# Altium project Customer.PrjPcb
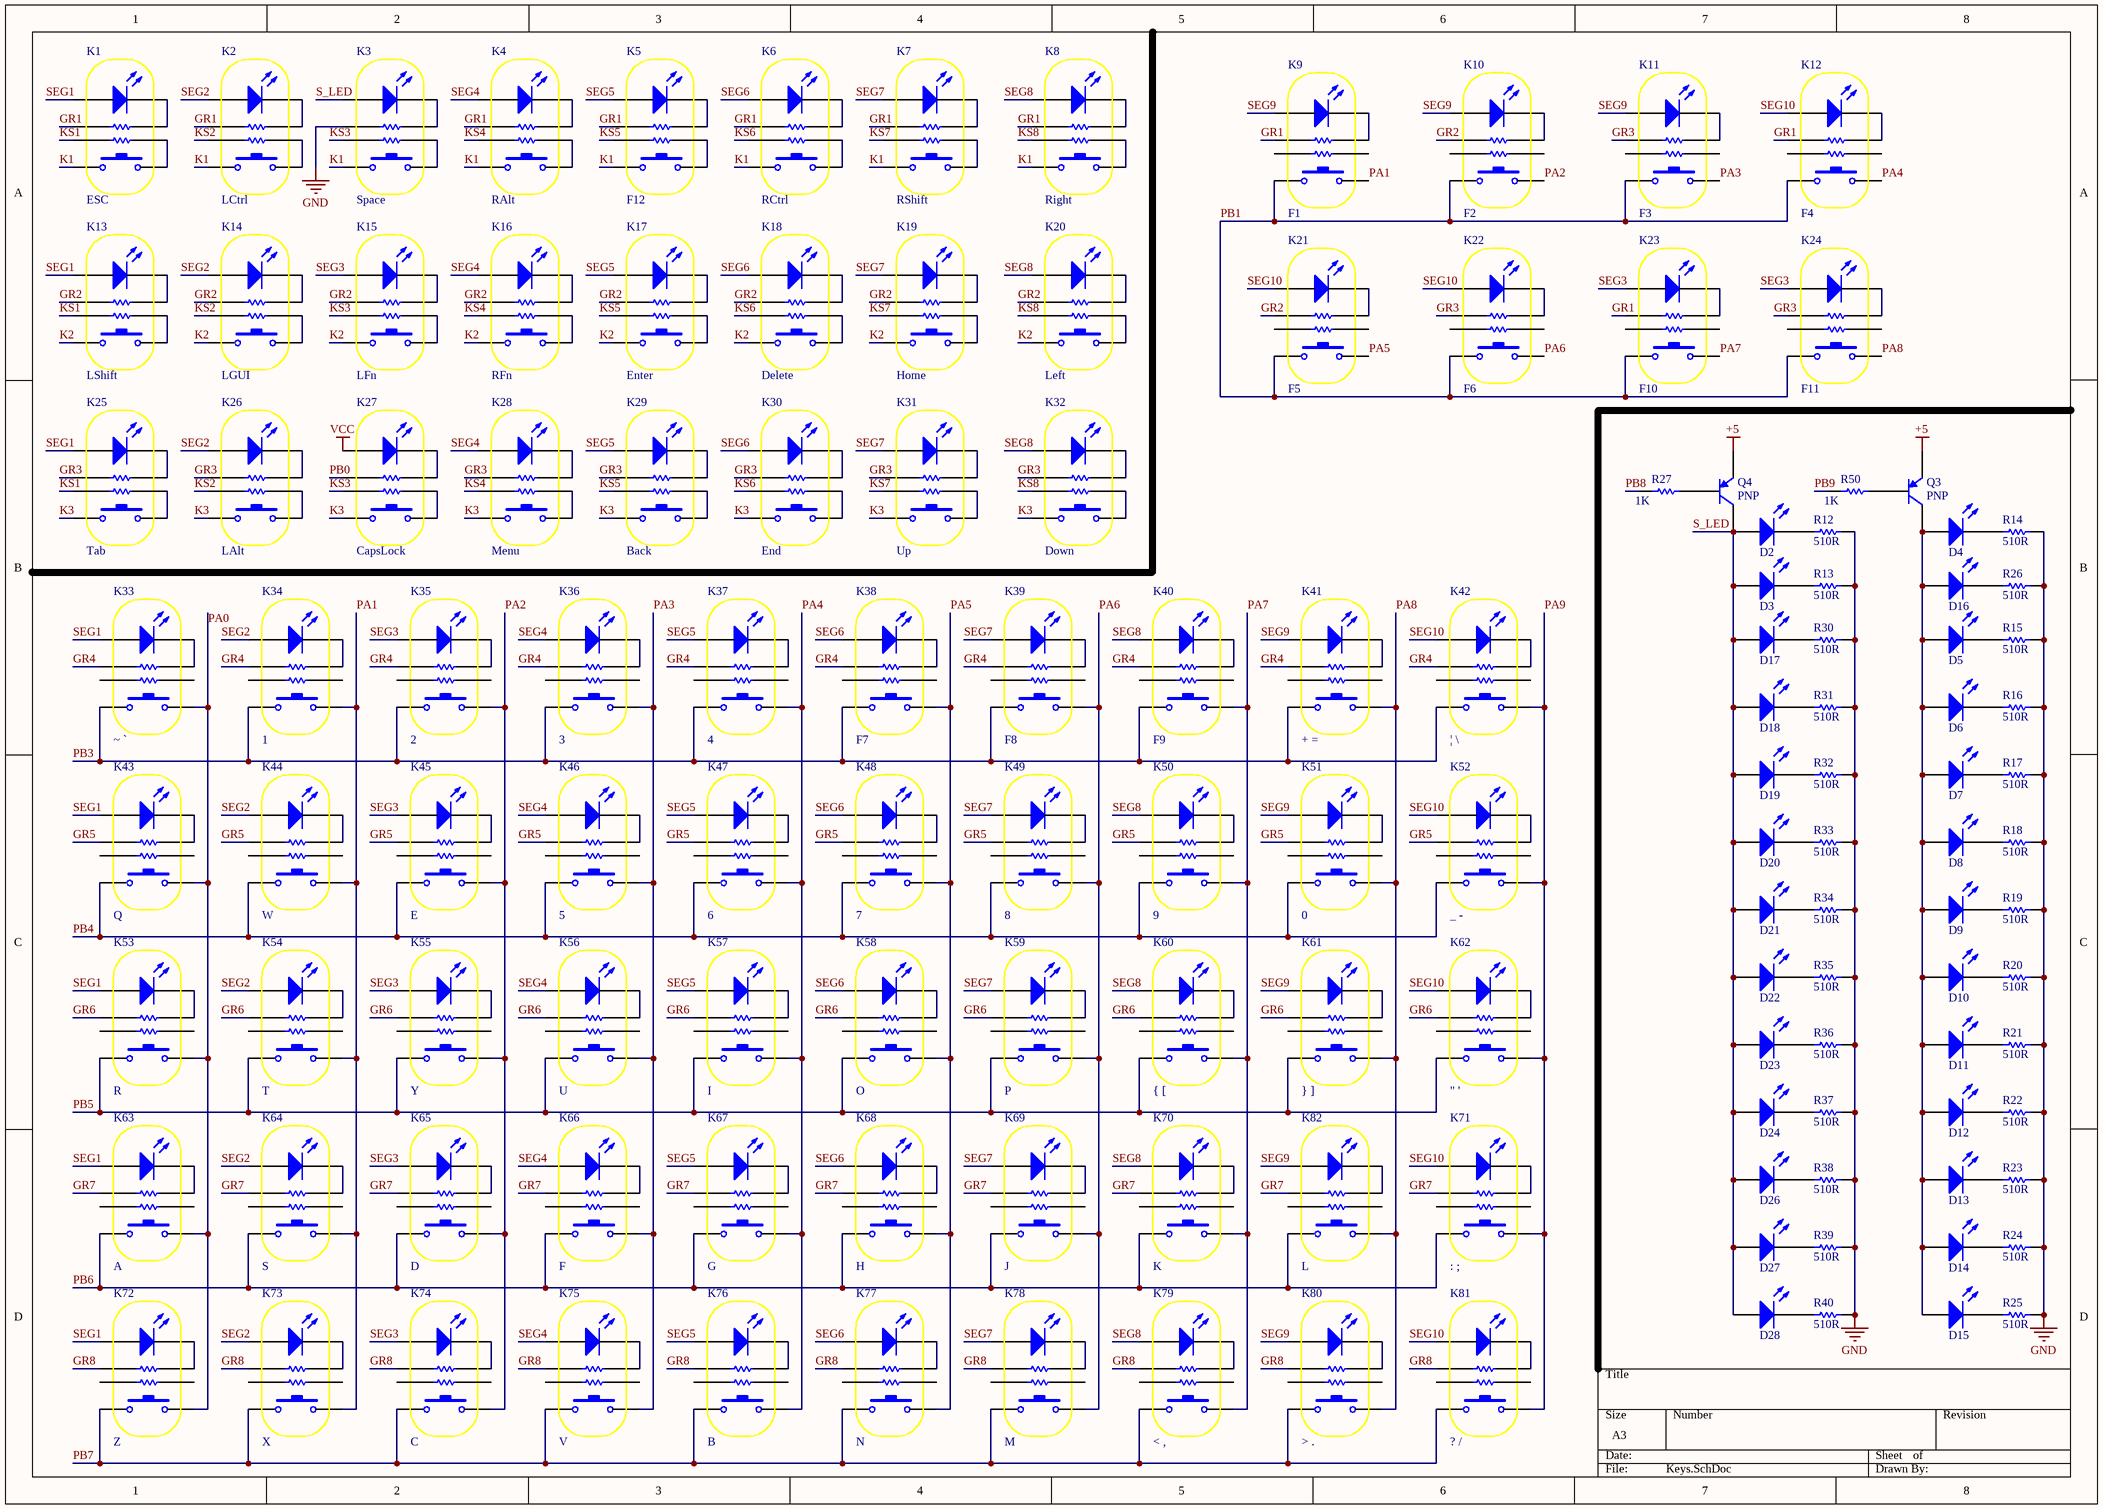
[diagram p0: Keys.SchDoc]
2 sheets, 207 parts. Net scope: global (net labels, ports and power ports of the same name join across sheets).
Board file: PCB.PcbDoc
Sheets:
  Keys.SchDoc
  Main.SchDoc

## Sheet Keys.SchDoc
size A3

### Parts
D2  LED  [LC-0603_LED_S3]  (value not drawn)
D3  LED  [LC-0603_LED_S3]  (value not drawn)
D4  LED  [LC-0603_LED_S3]  (value not drawn)
D5  LED  [LC-0603_LED_S3]  (value not drawn)
D6  LED  [LC-0603_LED_S3]  (value not drawn)
D7  LED  [LC-0603_LED_S3]  (value not drawn)
D8  LED  [LC-0603_LED_S3]  (value not drawn)
D9  LED  [LC-0603_LED_S3]  (value not drawn)
D10  LED  [LC-0603_LED_S3]  (value not drawn)
D11  LED  [LC-0603_LED_S3]  (value not drawn)
D12  LED  [LC-0603_LED_S3]  (value not drawn)
D13  LED  [LC-0603_LED_S3]  (value not drawn)
D14  LED  [LC-0603_LED_S3]  (value not drawn)
D15  LED  [LC-0603_LED_S3]  (value not drawn)
D16  LED  [LC-0603_LED_S3]  (value not drawn)
D17  LED  [LC-0603_LED_S3]  (value not drawn)
D18  LED  [LC-0603_LED_S3]  (value not drawn)
D19  LED  [LC-0603_LED_S3]  (value not drawn)
D20  LED  [LC-0603_LED_S3]  (value not drawn)
D21  LED  [LC-0603_LED_S3]  (value not drawn)
D22  LED  [LC-0603_LED_S3]  (value not drawn)
D23  LED  [LC-0603_LED_S3]  (value not drawn)
D24  LED  [LC-0603_LED_S3]  (value not drawn)
D26  LED  [LC-0603_LED_S3]  (value not drawn)
D27  LED  [LC-0603_LED_S3]  (value not drawn)
D28  LED  [LC-0603_LED_S3]  (value not drawn)
K1  ESC  [Key]
K2  LCtrl  [Key]
K3  Space  [Key]
K4  RAlt  [Key]
K5  F12  [Key]
K6  RCtrl  [Key]
K7  RShift  [Key]
K8  Right  [Key]
K9  F1  [Key]
K10  F2  [Key]
K11  F3  [Key]
K12  F4  [Key]
K13  LShift  [Key]
K14  LGUI  [Key]
K15  LFn  [Key]
K16  RFn  [Key]
K17  Enter  [Key]
K18  Delete  [Key]
K19  Home  [Key]
K20  Left  [Key]
K21  F5  [Key]
K22  F6  [Key]
K23  F10  [Key]
K24  F11  [Key]
K25  Tab  [Key]
K26  LAlt  [Key]
K27  CapsLock  [Key]
K28  Menu  [Key]
K29  Back  [Key]
K30  End  [Key]
K31  Up  [Key]
K32  Down  [Key]
K33  ~ `  [Key]
K34  1  [Key]
K35  2  [Key]
K36  3  [Key]
K37  4  [Key]
K38  F7  [Key]
K39  F8  [Key]
K40  F9  [Key]
K41  + =  [Key]
K42  | \  [Key]
K43  Q  [Key]
K44  W  [Key]
K45  E  [Key]
K46  5  [Key]
K47  6  [Key]
K48  7  [Key]
K49  8  [Key]
K50  9  [Key]
K51  0  [Key]
K52  _ -  [Key]
K53  R  [Key]
K54  T  [Key]
K55  Y  [Key]
K56  U  [Key]
K57  I  [Key]
K58  O  [Key]
K59  P  [Key]
K60  { [  [Key]
K61  } ]  [Key]
K62  " '  [Key]
K63  A  [Key]
K64  S  [Key]
K65  D  [Key]
K66  F  [Key]
K67  G  [Key]
K68  H  [Key]
K69  J  [Key]
K70  K  [Key]
K71  : ;  [Key]
K72  Z  [Key]
K73  X  [Key]
K74  C  [Key]
K75  V  [Key]
K76  B  [Key]
K77  N  [Key]
K78  M  [Key]
K79  < ,  [Key]
K80  > .  [Key]
K81  ? /  [Key]
K82  L  [Key]
Q3  PNP  [LC-SOT-23(SOT-23-3)]
Q4  PNP  [LC-SOT-23(SOT-23-3)]
R12  510R  [LC-0603_R]
R13  510R  [LC-0603_R]
R14  510R  [LC-0603_R]
R15  510R  [LC-0603_R]
R16  510R  [LC-0603_R]
R17  510R  [LC-0603_R]
R18  510R  [LC-0603_R]
R19  510R  [LC-0603_R]
R20  510R  [LC-0603_R]
R21  510R  [LC-0603_R]
R22  510R  [LC-0603_R]
R23  510R  [LC-0603_R]
R24  510R  [LC-0603_R]
R25  510R  [LC-0603_R]
R26  510R  [LC-0603_R]
R27  1K  [LC-0603_R]
R30  510R  [LC-0603_R]
R31  510R  [LC-0603_R]
R32  510R  [LC-0603_R]
R33  510R  [LC-0603_R]
R34  510R  [LC-0603_R]
R35  510R  [LC-0603_R]
R36  510R  [LC-0603_R]
R37  510R  [LC-0603_R]
R38  510R  [LC-0603_R]
R39  510R  [LC-0603_R]
R40  510R  [LC-0603_R]
R50  1K  [LC-0603_R]

### Nets
+5: Q3.3(E) Q4.3(E)
GND: K3.2(K) R12.2 R13.2 R14.2 R15.2 R16.2 R17.2 R18.2 R19.2 R20.2 R21.2 R22.2 R23.2 R24.2 R25.2 R26.2 R30.2 R31.2 R32.2 R33.2 R34.2 R35.2 R36.2 R37.2 R38.2 R39.2 R40.2
VCC: K27.1(A)
GR1: K1.2(K) K2.2(K) K4.2(K) K5.2(K) K6.2(K) K7.2(K) K8.2(K) K9.2(K) K12.2(K) K23.2(K)
GR2: K10.2(K) K13.2(K) K14.2(K) K15.2(K) K16.2(K) K17.2(K) K18.2(K) K19.2(K) K20.2(K) K21.2(K)
GR3: K11.2(K) K22.2(K) K24.2(K) K25.2(K) K26.2(K) K28.2(K) K29.2(K) K30.2(K) K31.2(K) K32.2(K)
GR4: K33.2(K) K34.2(K) K35.2(K) K36.2(K) K37.2(K) K38.2(K) K39.2(K) K40.2(K) K41.2(K) K42.2(K)
GR5: K43.2(K) K44.2(K) K45.2(K) K46.2(K) K47.2(K) K48.2(K) K49.2(K) K50.2(K) K51.2(K) K52.2(K)
GR6: K53.2(K) K54.2(K) K55.2(K) K56.2(K) K57.2(K) K58.2(K) K59.2(K) K60.2(K) K61.2(K) K62.2(K)
GR7: K63.2(K) K64.2(K) K65.2(K) K66.2(K) K67.2(K) K68.2(K) K69.2(K) K70.2(K) K71.2(K) K82.2(K)
GR8: K72.2(K) K73.2(K) K74.2(K) K75.2(K) K76.2(K) K77.2(K) K78.2(K) K79.2(K) K80.2(K) K81.2(K)
K1: K1.4 K2.4 K3.4 K4.4 K5.4 K6.4 K7.4 K8.4
K2: K13.4 K14.4 K15.4 K16.4 K17.4 K18.4 K19.4 K20.4
K3: K25.4 K26.4 K27.4 K28.4 K29.4 K30.4 K31.4 K32.4
KS1: K1.1(A) K1.3(A) K13.1(A) K13.3(A) K25.1(A) K25.3(A) K33.1(A) K43.1(A) K53.1(A) K63.1(A) K72.1(A)  [also labelled SEG1]
KS2: K2.1(A) K2.3(A) K14.1(A) K14.3(A) K26.1(A) K26.3(A) K34.1(A) K44.1(A) K54.1(A) K64.1(A) K73.1(A)  [also labelled SEG2]
KS3: K3.3(A) K15.1(A) K15.3(A) K23.1(A) K24.1(A) K27.3(A) K35.1(A) K45.1(A) K55.1(A) K65.1(A) K74.1(A)  [also labelled SEG3]
KS4: K4.1(A) K4.3(A) K16.1(A) K16.3(A) K28.1(A) K28.3(A) K36.1(A) K46.1(A) K56.1(A) K66.1(A) K75.1(A)  [also labelled SEG4]
KS5: K5.1(A) K5.3(A) K17.1(A) K17.3(A) K29.1(A) K29.3(A) K37.1(A) K47.1(A) K57.1(A) K67.1(A) K76.1(A)  [also labelled SEG5]
KS6: K6.1(A) K6.3(A) K18.1(A) K18.3(A) K30.1(A) K30.3(A) K38.1(A) K48.1(A) K58.1(A) K68.1(A) K77.1(A)  [also labelled SEG6]
KS7: K7.1(A) K7.3(A) K19.1(A) K19.3(A) K31.1(A) K31.3(A) K39.1(A) K49.1(A) K59.1(A) K69.1(A) K78.1(A)  [also labelled SEG7]
KS8: K8.1(A) K8.3(A) K20.1(A) K20.3(A) K32.1(A) K32.3(A) K40.1(A) K50.1(A) K60.1(A) K70.1(A) K79.1(A)  [also labelled SEG8]
PA0: K33.5 K43.5 K53.5 K63.5 K72.5
PA1: K9.5 K34.5 K44.5 K54.5 K64.5 K73.5
PA2: K10.5 K35.5 K45.5 K55.5 K65.5 K74.5
PA3: K11.5 K36.5 K46.5 K56.5 K66.5 K75.5
PA4: K12.5 K37.5 K47.5 K57.5 K67.5 K76.5
PA5: K21.5 K38.5 K48.5 K58.5 K68.5 K77.5
PA6: K22.5 K39.5 K49.5 K59.5 K69.5 K78.5
PA7: K23.5 K40.5 K50.5 K60.5 K70.5 K79.5
PA8: K24.5 K41.5 K51.5 K61.5 K80.5 K82.5
PA9: K42.5 K52.5 K62.5 K71.5 K81.5
PB0: K27.2(K)
PB1: K9.4 K10.4 K11.4 K12.4 K21.4 K22.4 K23.4 K24.4
PB3: K33.4 K34.4 K35.4 K36.4 K37.4 K38.4 K39.4 K40.4 K41.4 K42.4
PB4: K43.4 K44.4 K45.4 K46.4 K47.4 K48.4 K49.4 K50.4 K51.4 K52.4
PB5: K53.4 K54.4 K55.4 K56.4 K57.4 K58.4 K59.4 K60.4 K61.4 K62.4
PB6: K63.4 K64.4 K65.4 K66.4 K67.4 K68.4 K69.4 K70.4 K71.4 K82.4
PB7: K72.4 K73.4 K74.4 K75.4 K76.4 K77.4 K78.4 K79.4 K80.4 K81.4
PB8: R27.1
PB9: R50.1
S_LED: D2.A D3.A D17.A D18.A D19.A D20.A D21.A D22.A D23.A D24.A D26.A D27.A D28.A K3.1(A) Q4.1(C)
SEG9: K9.1(A) K10.1(A) K11.1(A) K41.1(A) K51.1(A) K61.1(A) K80.1(A) K82.1(A)
SEG10: K12.1(A) K21.1(A) K22.1(A) K42.1(A) K52.1(A) K62.1(A) K71.1(A) K81.1(A)
NetD2_K: D2.K R12.1
NetD3_K: D3.K R13.1
NetD4_A: D4.A D5.A D6.A D7.A D8.A D9.A D10.A D11.A D12.A D13.A D14.A D15.A D16.A Q3.1(C)
NetD4_K: D4.K R14.1
NetD5_K: D5.K R15.1
NetD6_K: D6.K R16.1
NetD7_K: D7.K R17.1
NetD8_K: D8.K R18.1
NetD9_K: D9.K R19.1
NetD10_K: D10.K R20.1
NetD11_K: D11.K R21.1
NetD12_K: D12.K R22.1
NetD13_K: D13.K R23.1
NetD14_K: D14.K R24.1
NetD15_K: D15.K R25.1
NetD16_K: D16.K R26.1
NetD17_K: D17.K R30.1
NetD18_K: D18.K R31.1
NetD19_K: D19.K R32.1
NetD20_K: D20.K R33.1
NetD21_K: D21.K R34.1
NetD22_K: D22.K R35.1
NetD23_K: D23.K R36.1
NetD24_K: D24.K R37.1
NetD26_K: D26.K R38.1
NetD27_K: D27.K R39.1
NetD28_K: D28.K R40.1
NetK1_5: K1.5 K1.6(K)
NetK1_7: K1.7(K) K1.8(K)
NetK2_5: K2.5 K2.6(K)
NetK2_7: K2.7(K) K2.8(K)
NetK3_5: K3.5 K3.6(K)
NetK3_7: K3.7(K) K3.8(K)
NetK4_5: K4.5 K4.6(K)
NetK4_7: K4.7(K) K4.8(K)
NetK5_5: K5.5 K5.6(K)
NetK5_7: K5.7(K) K5.8(K)
NetK6_5: K6.5 K6.6(K)
NetK6_7: K6.7(K) K6.8(K)
NetK7_5: K7.5 K7.6(K)
NetK7_7: K7.7(K) K7.8(K)
NetK8_5: K8.5 K8.6(K)
NetK8_7: K8.7(K) K8.8(K)
NetK9_7: K9.7(K) K9.8(K)
NetK10_7: K10.7(K) K10.8(K)
NetK11_7: K11.7(K) K11.8(K)
NetK12_7: K12.7(K) K12.8(K)
NetK13_5: K13.5 K13.6(K)
NetK13_7: K13.7(K) K13.8(K)
NetK14_5: K14.5 K14.6(K)
NetK14_7: K14.7(K) K14.8(K)
NetK15_5: K15.5 K15.6(K)
NetK15_7: K15.7(K) K15.8(K)
NetK16_5: K16.5 K16.6(K)
NetK16_7: K16.7(K) K16.8(K)
NetK17_5: K17.5 K17.6(K)
NetK17_7: K17.7(K) K17.8(K)
NetK18_5: K18.5 K18.6(K)
NetK18_7: K18.7(K) K18.8(K)
NetK19_5: K19.5 K19.6(K)
NetK19_7: K19.7(K) K19.8(K)
NetK20_5: K20.5 K20.6(K)
NetK20_7: K20.7(K) K20.8(K)
NetK21_7: K21.7(K) K21.8(K)
NetK22_7: K22.7(K) K22.8(K)
NetK23_7: K23.7(K) K23.8(K)
NetK24_7: K24.7(K) K24.8(K)
NetK25_5: K25.5 K25.6(K)
NetK25_7: K25.7(K) K25.8(K)
NetK26_5: K26.5 K26.6(K)
NetK26_7: K26.7(K) K26.8(K)
NetK27_5: K27.5 K27.6(K)
NetK27_7: K27.7(K) K27.8(K)
NetK28_5: K28.5 K28.6(K)
NetK28_7: K28.7(K) K28.8(K)
NetK29_5: K29.5 K29.6(K)
NetK29_7: K29.7(K) K29.8(K)
NetK30_5: K30.5 K30.6(K)
NetK30_7: K30.7(K) K30.8(K)
NetK31_5: K31.5 K31.6(K)
NetK31_7: K31.7(K) K31.8(K)
NetK32_5: K32.5 K32.6(K)
NetK32_7: K32.7(K) K32.8(K)
NetK33_7: K33.7(K) K33.8(K)
NetK34_7: K34.7(K) K34.8(K)
NetK35_7: K35.7(K) K35.8(K)
NetK36_7: K36.7(K) K36.8(K)
NetK37_7: K37.7(K) K37.8(K)
NetK38_7: K38.7(K) K38.8(K)
NetK39_7: K39.7(K) K39.8(K)
NetK40_7: K40.7(K) K40.8(K)
NetK41_7: K41.7(K) K41.8(K)
NetK42_7: K42.7(K) K42.8(K)
NetK43_7: K43.7(K) K43.8(K)
NetK44_7: K44.7(K) K44.8(K)
NetK45_7: K45.7(K) K45.8(K)
NetK46_7: K46.7(K) K46.8(K)
NetK47_7: K47.7(K) K47.8(K)
NetK48_7: K48.7(K) K48.8(K)
NetK49_7: K49.7(K) K49.8(K)
NetK50_7: K50.7(K) K50.8(K)
NetK51_7: K51.7(K) K51.8(K)
NetK52_7: K52.7(K) K52.8(K)
NetK53_7: K53.7(K) K53.8(K)
NetK54_7: K54.7(K) K54.8(K)
NetK55_7: K55.7(K) K55.8(K)
NetK56_7: K56.7(K) K56.8(K)
NetK57_7: K57.7(K) K57.8(K)
NetK58_7: K58.7(K) K58.8(K)
NetK59_7: K59.7(K) K59.8(K)
NetK60_7: K60.7(K) K60.8(K)
NetK61_7: K61.7(K) K61.8(K)
NetK62_7: K62.7(K) K62.8(K)
NetK63_7: K63.7(K) K63.8(K)
NetK64_7: K64.7(K) K64.8(K)
NetK65_7: K65.7(K) K65.8(K)
NetK66_7: K66.7(K) K66.8(K)
NetK67_7: K67.7(K) K67.8(K)
NetK68_7: K68.7(K) K68.8(K)
NetK69_7: K69.7(K) K69.8(K)
NetK70_7: K70.7(K) K70.8(K)
NetK71_7: K71.7(K) K71.8(K)
NetK72_7: K72.7(K) K72.8(K)
NetK73_7: K73.7(K) K73.8(K)
NetK74_7: K74.7(K) K74.8(K)
NetK75_7: K75.7(K) K75.8(K)
NetK76_7: K76.7(K) K76.8(K)
NetK77_7: K77.7(K) K77.8(K)
NetK78_7: K78.7(K) K78.8(K)
NetK79_7: K79.7(K) K79.8(K)
NetK80_7: K80.7(K) K80.8(K)
NetK81_7: K81.7(K) K81.8(K)
NetK82_7: K82.7(K) K82.8(K)
NetQ3_2: Q3.2(B) R50.2
NetQ4_2: Q4.2(B) R27.2

Not connected (* = marked no-connect by the designer): K9 3(A) 6(K); K10 3(A) 6(K); K11 3(A) 6(K); K12 3(A) 6(K); K21 3(A) 6(K); K22 3(A) 6(K); K23 3(A) 6(K); K24 3(A) 6(K); K33 3(A) 6(K); K34 3(A) 6(K); K35 3(A) 6(K); K36 3(A) 6(K); K37 3(A) 6(K); K38 3(A) 6(K); K39 3(A) 6(K); K40 3(A) 6(K); K41 3(A) 6(K); K42 3(A) 6(K); K43 3(A) 6(K); K44 3(A) 6(K); K45 3(A) 6(K); K46 3(A) 6(K); K47 3(A) 6(K); K48 3(A) 6(K); K49 3(A) 6(K); K50 3(A) 6(K); K51 3(A) 6(K); K52 3(A) 6(K); K53 3(A) 6(K); K54 3(A) 6(K); K55 3(A) 6(K); K56 3(A) 6(K); K57 3(A) 6(K); K58 3(A) 6(K); K59 3(A) 6(K); K60 3(A) 6(K); K61 3(A) 6(K); K62 3(A) 6(K); K63 3(A) 6(K); K64 3(A) 6(K); K65 3(A) 6(K); K66 3(A) 6(K); K67 3(A) 6(K); K68 3(A) 6(K); K69 3(A) 6(K); K70 3(A) 6(K); K71 3(A) 6(K); K72 3(A) 6(K); K73 3(A) 6(K); K74 3(A) 6(K); K75 3(A) 6(K); K76 3(A) 6(K); K77 3(A) 6(K); K78 3(A) 6(K); K79 3(A) 6(K); K80 3(A) 6(K); K81 3(A) 6(K); K82 3(A) 6(K)

### Library data of the parts
D2-D24 D26-D28 = LED: Typical INFRARED GaAs LED; Published: 8-Jun-2000; LatestRevisionDate: 08-Jul-2005; LatestRevisionNote: Mech Layer 1 removed.; PackageReference: LED-0; Publisher: Altium Limited; PackageDescription: LED; 2 Leads
K1-K82 = Key: 510R
Q3 Q4 = PNP: PNP Bipolar Transistor; Published: 8-Jun-2000; LatestRevisionDate: 29-May-2009; LatestRevisionNote: IPC-7351 Footprint Added.; PackageVersion: Aug-1999; PackageReference: SOT-23B; Publisher: Altium Limited; PackageDescription: 3-Pin SOT-23 Package 0.95 mm Pitch, 2.4 mm Lead Span
R12-R27 R30-R40 R50 = Resistor: Value: 150R; Published: 8-Jun-2000; LatestRevisionDate: 17-Jul-2002; LatestRevisionNote: Re-released for DXP Platform.; PackageReference: AXIAL-0.3; Publisher: Altium Limited; PackageDescription: Axial Device, Thru-Hole; 2 Leads; 0.3 in Pin Spacing

## Sheet Main.SchDoc
size A4
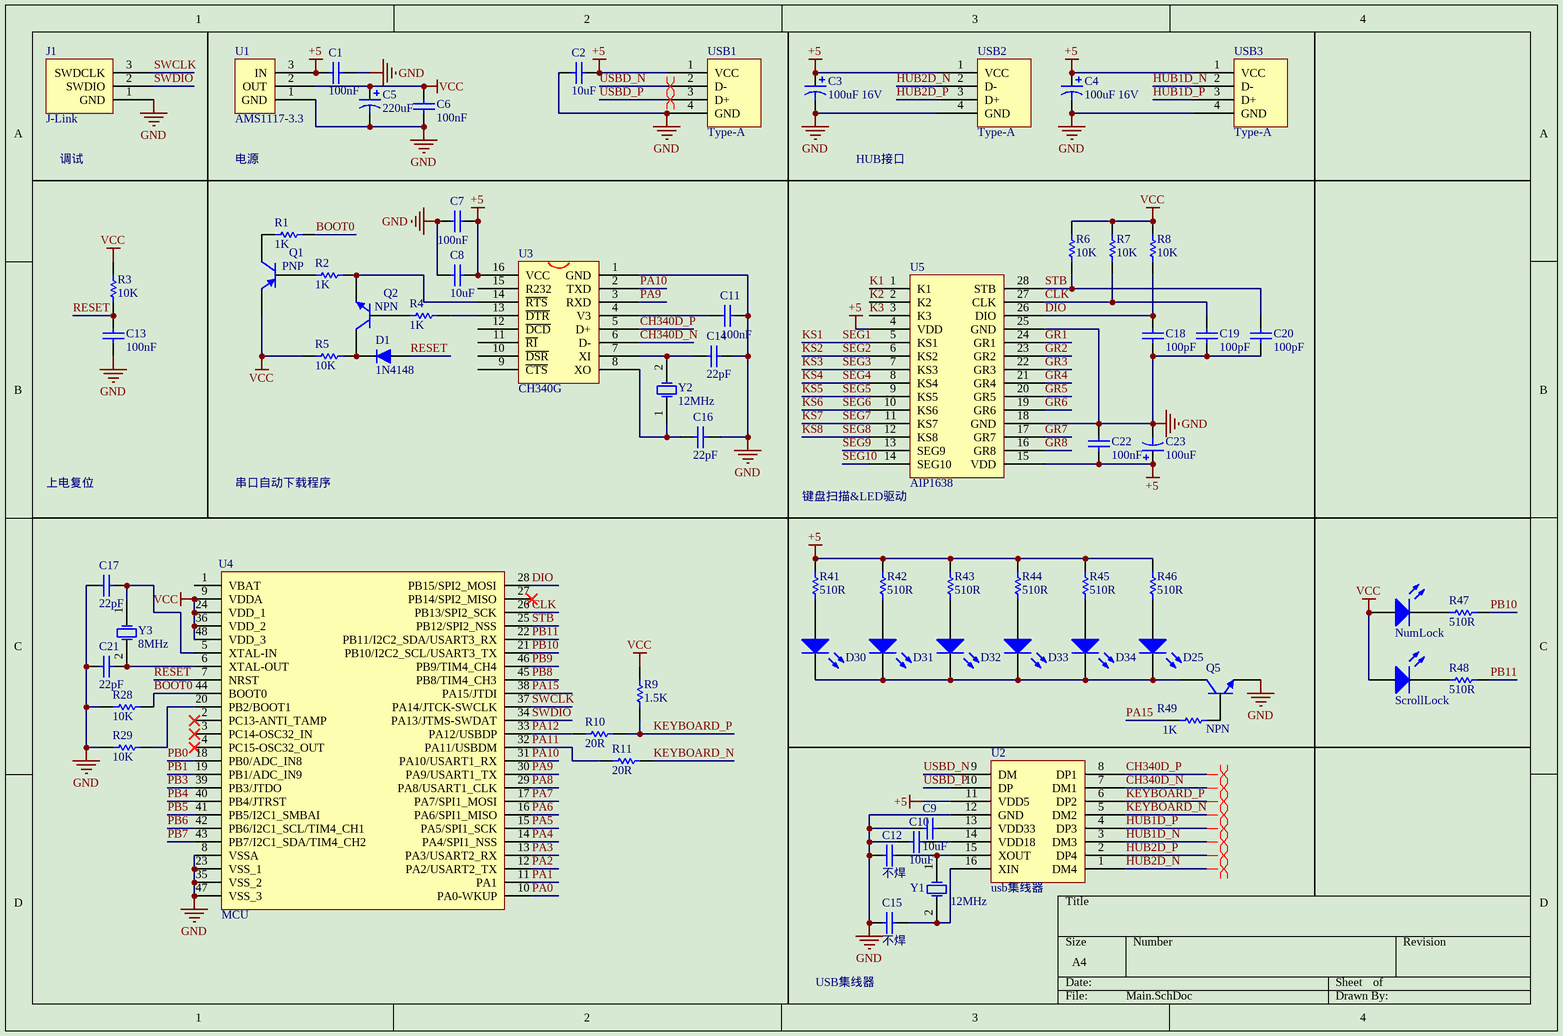
[diagram p1: Main.SchDoc]

### Parts
C1  100nF  [LC-1206_C]
C2  10uF  [LC-0603_C]
C3  100uF 16V  [贴片电解 6.3*5.4]
C4  100uF 16V  [贴片电解 6.3*5.4]
C5  220uF  [贴片电解 8*10.2]
C6  100nF  [LC-1206_C]
C7  100nF  [LC-1206_C]
C8  10uF  [LC-0603_C]
C9  10uF  [LC-0603_C]
C10  10uF  [LC-0603_C]
C11  100nF  [LC-1206_C]
C12  不焊  [LC-0603_C]
C13  100nF  [LC-1206_C]
C14  22pF  [LC-1206_C]
C15  不焊  [LC-0603_C]
C16  22pF  [LC-1206_C]
C17  22pF  [LC-1206_C]
C18  100pF  [LC-0603_C]
C19  100pF  [LC-0603_C]
C20  100pF  [LC-0603_C]
C21  22pF  [LC-1206_C]
C22  100nF  [LC-1206_C]
C23  100uF  [贴片电解 6.3*5.4]
D1  1N4148  [LC-DO-35]
D25  LED  [LC-0603_LED_S3]  (value not drawn)
D30  LED  [LC-0603_LED_S3]  (value not drawn)
D31  LED  [LC-0603_LED_S3]  (value not drawn)
D32  LED  [LC-0603_LED_S3]  (value not drawn)
D33  LED  [LC-0603_LED_S3]  (value not drawn)
D34  LED  [LC-0603_LED_S3]  (value not drawn)
J1  J-Link  [IDE3]
NumLock  LED  [LC-0603_LED_S3]  (value not drawn)
Q1  PNP  [LC-SOT-23(SOT-23-3)]
Q2  NPN  [LC-SOT-23(SOT-23-3)]
Q5  NPN  [LC-SOT-23(SOT-23-3)]
R1  1K  [LC-0603_R]
R2  1K  [LC-0603_R]
R3  10K  [LC-1206_R]
R4  1K  [LC-0603_R]
R5  10K  [LC-1206_R]
R6  10K  [LC-1206_R]
R7  10K  [LC-1206_R]
R8  10K  [LC-1206_R]
R9  1.5K  [LC-1206_R]
R10  20R  [LC-0603_R]
R11  20R  [LC-0603_R]
R28  10K  [LC-1206_R]
R29  10K  [LC-1206_R]
R41  510R  [LC-0603_R]
R42  510R  [LC-0603_R]
R43  510R  [LC-0603_R]
R44  510R  [LC-0603_R]
R45  510R  [LC-0603_R]
R46  510R  [LC-0603_R]
R47  510R  [LC-0603_R]
R48  510R  [LC-0603_R]
R49  1K  [LC-0603_R]
ScrollLock  LED  [LC-0603_LED_S3]  (value not drawn)
U1  AMS1117-3.3  [LC-SOT-223]
U2  usb集线器  [LC-SOP-16_150mil]
U3  CH340G  [LC-SOP-16_150mil]
U4  MCU  [lqfp48]
U5  AIP1638  [LC-SOP-28_300mil]
USB1  Type-A  [USB]
USB2  Type-A  [USB A型]
USB3  Type-A  [USB A型]
Y1  12MHz  [LC-HC-49S]
Y2  12MHz  [LC-HC-49S]
Y3  8MHz  [LC-HC-49S]

### Nets
+5: C1.2 C2.1 C3.1 C4.1 C7.2 C8.1 C22.1 C23.1 R41.2 R42.2 R43.2 R44.2 R45.2 R46.2 U1.3(IN) U2.11(VDD5) U3.16(VCC) U5.4(VDD) U5.15(VDD) USB1.1(VCC) USB2.1(VCC) USB3.1(VCC)
GND: C1.1 C2.2 C3.2 C4.2 C5.2 C6.2 C7.1 C8.2 C9.2 C10.2 C11.2 C12.2 C13.1 C14.2 C15.2 C16.2 C17.1 C18.1 C19.1 C20.1 C21.1 C22.2 C23.2 J1.1(GND) Q5.3(E) R28.1 R29.1 U1.1(GND) U2.12(GND) U3.1(GND) U4.8(VSSA) U4.23(VSS_1) U4.35(VSS_2) U4.47(VSS_3) U5.18(GND) U5.25(GND) USB1.4(GND) USB2.4(GND) USB3.4(GND)
VCC: C5.1 C6.1 NumLock.A Q1.3(E) R3.2 R5.1 R6.2 R7.2 R8.2 R9.2 ScrollLock.A U1.2(OUT) U4.9(VDDA) U4.24(VDD_1) U4.36(VDD_2) U4.48(VDD_3)
BOOT0: R1.2 R28.2 U4.44(BOOT0)
CH340D_N: U2.7(DM1) U3.6(D-)
CH340D_P: U2.8(DP1) U3.5(D+)
CLK: C19.2 R7.1 U4.26(PB13/SPI2_SCK) U5.27(CLK)
DIO: C18.2 R8.1 U4.28(PB15/SPI2_MOSI) U5.26(DIO)
GR1: U5.24(GR1)
GR2: U5.23(GR2)
GR3: U5.22(GR3)
GR4: U5.21(GR4)
GR5: U5.20(GR5)
GR6: U5.19(GR6)
GR7: U5.17(GR7)
GR8: U5.16(GR8)
HUB1D_N: U2.3(DM3) USB3.2(D-)
HUB1D_P: U2.4(DP3) USB3.3(D+)
HUB2D_N: U2.1(DM4) USB2.2(D-)
HUB2D_P: U2.2(DP4) USB2.3(D+)
K1: U5.1(K1)
K2: U5.2(K2)
K3: U5.3(K3)
KEYBOARD_N: R11.2 U2.5(DM2)
KEYBOARD_P: R9.1 R10.2 U2.6(DP2)
KS1: U5.5(KS1)  [also labelled SEG1]
KS2: U5.6(KS2)  [also labelled SEG2]
KS3: U5.7(KS3)  [also labelled SEG3]
KS4: U5.8(KS4)  [also labelled SEG4]
KS5: U5.9(KS5)  [also labelled SEG5]
KS6: U5.10(KS6)  [also labelled SEG6]
KS7: U5.11(KS7)  [also labelled SEG7]
KS8: U5.12(KS8)  [also labelled SEG8]
PA0: U4.10(PA0-WKUP)
PA1: U4.11(PA1)
PA2: U4.12(PA2/USART2_TX)
PA3: U4.13(PA3/USART2_RX)
PA4: U4.14(PA4/SPI1_NSS)
PA5: U4.15(PA5/SPI1_SCK)
PA6: U4.16(PA6/SPI1_MISO)
PA7: U4.17(PA7/SPI1_MOSI)
PA8: U4.29(PA8/USART1_CLK)
PA9: U3.3(RXD) U4.30(PA9/USART1_TX)
PA10: U3.2(TXD) U4.31(PA10/USART1_RX)
PA11: R11.1 U4.32(PA11/USBDM)
PA12: R10.1 U4.33(PA12/USBDP)
PA15: R49.1 U4.38(PA15/JTDI)
PB0: U4.18(PB0/ADC_IN8)
PB1: U4.19(PB1/ADC_IN9)
PB3: U4.39(PB3/JTDO)
PB4: U4.40(PB4/JTRST)
PB5: U4.41(PB5/I2C1_SMBAI)
PB6: U4.42(PB6/I2C1_SCL/TIM4_CH1)
PB7: U4.43(PB7/I2C1_SDA/TIM4_CH2)
PB8: U4.45(PB8/TIM4_CH3)
PB9: U4.46(PB9/TIM4_CH4)
PB10: R47.2 U4.21(PB10/I2C2_SCL/USART3_TX)
PB11: R48.2 U4.22(PB11/I2C2_SDA/USART3_RX)
RESET: C13.2 D1.1(A) R3.1 U4.7(NRST)
SEG9: U5.13(SEG9)
SEG10: U5.14(SEG10)
STB: C20.2 R6.1 U4.25(PB12/SPI2_NSS) U5.28(STB)
SWCLK: J1.3(SWDCLK) U4.37(PA14/JTCK-SWCLK)
SWDIO: J1.2(SWDIO) U4.34(PA13/JTMS-SWDAT)
USBD_N: U2.9(DM) USB1.2(D-)
USBD_P: U2.10(DP) USB1.3(D+)
NetC9_1: C9.1 U2.13(VDD33)
NetC10_1: C10.1 U2.14(VDD18)
NetC11_1: C11.1 U3.4(V3)
NetC12_1: C12.1 U2.15(XOUT) Y1.1(OSC1)
NetC14_1: C14.1 U3.7(XI) Y2.2(OSC2)
NetC15_1: C15.1 U2.16(XIN) Y1.2(OSC2)
NetC16_1: C16.1 U3.8(XO) Y2.1(OSC1)
NetC17_2: C17.2 U4.5(XTAL-IN) Y3.1(OSC1)
NetC21_2: C21.2 U4.6(XTAL-OUT) Y3.2(OSC2)
NetD1_2: D1.2(K) Q2.1(C) R5.2
NetD25_A: D25.A R46.1
NetD25_K: D25.K D30.K D31.K D32.K D33.K D34.K Q5.1(C)
NetD30_A: D30.A R41.1
NetD31_A: D31.A R42.1
NetD32_A: D32.A R43.1
NetD33_A: D33.A R44.1
NetD34_A: D34.A R45.1
NetNumLock_K: NumLock.K R47.1
NetQ1_1: Q1.1(C) R1.1
NetQ1_2: Q1.2(B) R2.1
NetQ2_2: Q2.2(B) R4.1
NetQ2_3: Q2.3(E) R2.2 U3.14(~{RTS})
NetQ5_2: Q5.2(B) R49.2
NetR4_2: R4.2 U3.13(~{DTR})
NetR29_2: R29.2 U4.20(PB2/BOOT1)
NetR48_1: R48.1 ScrollLock.K

Not connected (* = marked no-connect by the designer): U3 9(~{CTS}) 10(~{DSR}) 11(~{RI}) 12(~{DCD}) 15(R232); U4 1(VBAT) 2(PC13-ANTI_TAMP)* 3(PC14-OSC32_IN)* 4(PC15-OSC32_OUT)* 27(PB14/SPI2_MISO)*

### Layout directives
differential pair: CH340D_N, CH340D_P, HUB1D_N, HUB1D_P, HUB2D_N, HUB2D_P, KEYBOARD_N, KEYBOARD_P, USBD_N, USBD_P

### Notes on the sheet
- 调试
- 电源
- HUB接口
- 上电复位
- 串口自动下载程序
- 键盘扫描&LED驱动
- USB集线器

### Library data of the parts
C1 C2 C6-C13 C15 C18-C20 C22 = Capacitor: Value: 22pF; Published: 8-Jun-2000; LatestRevisionDate: 17-Jul-2002; LatestRevisionNote: Re-released for DXP Platform.; PackageReference: RAD-0.3; Publisher: Altium Limited; PackageDescription: Radial Cap, Thru-Hole; 2 Leads; 0.3 in Pin Spacing
C3-C5 C23 = Cap Pol: Polarized Capacitor (Axial); Value: 100pF; Published: 8-Jun-2000; LatestRevisionDate: 17-Jul-2002; LatestRevisionNote: Re-released for DXP Platform.; PackageReference: POLAR0.8; Publisher: Altium Limited; PackageDescription: Polarized Capacitor; 2 Leads
C14 C16 C17 C21 = Capacitor: Published: 8-Jun-2000; LatestRevisionDate: 17-Jul-2002; LatestRevisionNote: Re-released for DXP Platform.; PackageReference: RAD-0.3; Publisher: Altium Limited; PackageDescription: Radial Cap, Thru-Hole; 2 Leads; 0.3 in Pin Spacing; Value: 22pF
D1 = DO-214AC 肖特基
D25 D30-D34 NumLock ScrollLock = LED: Typical INFRARED GaAs LED; Published: 8-Jun-2000; LatestRevisionDate: 08-Jul-2005; LatestRevisionNote: Mech Layer 1 removed.; PackageReference: LED-0; Publisher: Altium Limited; PackageDescription: LED; 2 Leads
Q1 = PNP: PNP Bipolar Transistor; Published: 8-Jun-2000; LatestRevisionDate: 29-May-2009; LatestRevisionNote: IPC-7351 Footprint Added.; PackageVersion: Aug-1999; PackageReference: SOT-23B; Publisher: Altium Limited; PackageDescription: 3-Pin SOT-23 Package 0.95 mm Pitch, 2.4 mm Lead Span
Q2 Q5 = NPN: NPN Bipolar Transistor; Published: 8-Jun-2000; LatestRevisionDate: 17-Jul-2002; LatestRevisionNote: Re-released for DXP Platform.; PackageReference: TO-226-AA; Publisher: Altium Limited; PackageDescription: TO, Flat Index; 3 In-Line, Axial Leads; Body Dia. 4.8mm; Leads 0.55 x 0.51 mm (max); Code_JEDEC: TO-226-AA
R1-R11 R28 R29 R41-R49 = Resistor: Value: 150R; Published: 8-Jun-2000; LatestRevisionDate: 17-Jul-2002; LatestRevisionNote: Re-released for DXP Platform.; PackageReference: AXIAL-0.3; Publisher: Altium Limited; PackageDescription: Axial Device, Thru-Hole; 2 Leads; 0.3 in Pin Spacing
U1 = AMS1117
U2 = SL2.1A
U3 = CH340
U4 = STM32F103C8T6
USB1-USB3 = USB-A
Y1-Y3 = XTAL: Crystal Oscillator; Published: 8-Jun-2000; LatestRevisionDate: 17-Jul-2002; LatestRevisionNote: Re-released for DXP Platform.; PackageReference: R38; Publisher: Altium Limited; PackageDescription: Crystal, Thru-Hole; 2 Leads; Body 3.1 x 8.2 mm (Dia.xH)

## Nets that join several sheets
+5: Keys (Q3.3 Q4.3), Main (22 pins)
GND: Keys (27 pins), Main (39 pins)
VCC: Keys (K27.1), Main (16 pins)
GR1: Keys (10 pins), Main (U5.24)
GR2: Keys (10 pins), Main (U5.23)
GR3: Keys (10 pins), Main (U5.22)
GR4: Keys (10 pins), Main (U5.21)
GR5: Keys (10 pins), Main (U5.20)
GR6: Keys (10 pins), Main (U5.19)
GR7: Keys (10 pins), Main (U5.17)
GR8: Keys (10 pins), Main (U5.16)
K1: Keys (8 pins), Main (U5.1)
K2: Keys (8 pins), Main (U5.2)
K3: Keys (8 pins), Main (U5.3)
KS1: Keys (11 pins), Main (U5.5)
KS2: Keys (11 pins), Main (U5.6)
KS3: Keys (11 pins), Main (U5.7)
KS4: Keys (11 pins), Main (U5.8)
KS5: Keys (11 pins), Main (U5.9)
KS6: Keys (11 pins), Main (U5.10)
KS7: Keys (11 pins), Main (U5.11)
KS8: Keys (11 pins), Main (U5.12)
PA0: Keys (5 pins), Main (U4.10)
PA1: Keys (6 pins), Main (U4.11)
PA2: Keys (6 pins), Main (U4.12)
PA3: Keys (6 pins), Main (U4.13)
PA4: Keys (6 pins), Main (U4.14)
PA5: Keys (6 pins), Main (U4.15)
PA6: Keys (6 pins), Main (U4.16)
PA7: Keys (6 pins), Main (U4.17)
PA8: Keys (6 pins), Main (U4.29)
PA9: Keys (5 pins), Main (U3.3 U4.30)
PB0: Keys (K27.2), Main (U4.18)
PB1: Keys (8 pins), Main (U4.19)
PB3: Keys (10 pins), Main (U4.39)
PB4: Keys (10 pins), Main (U4.40)
PB5: Keys (10 pins), Main (U4.41)
PB6: Keys (10 pins), Main (U4.42)
PB7: Keys (10 pins), Main (U4.43)
PB8: Keys (R27.1), Main (U4.45)
PB9: Keys (R50.1), Main (U4.46)
SEG9: Keys (8 pins), Main (U5.13)
SEG10: Keys (8 pins), Main (U5.14)